# Altium schematic sheet [03] - ROGO MAIN.SchDoc
size A3; NameAuthor: Angle Vu
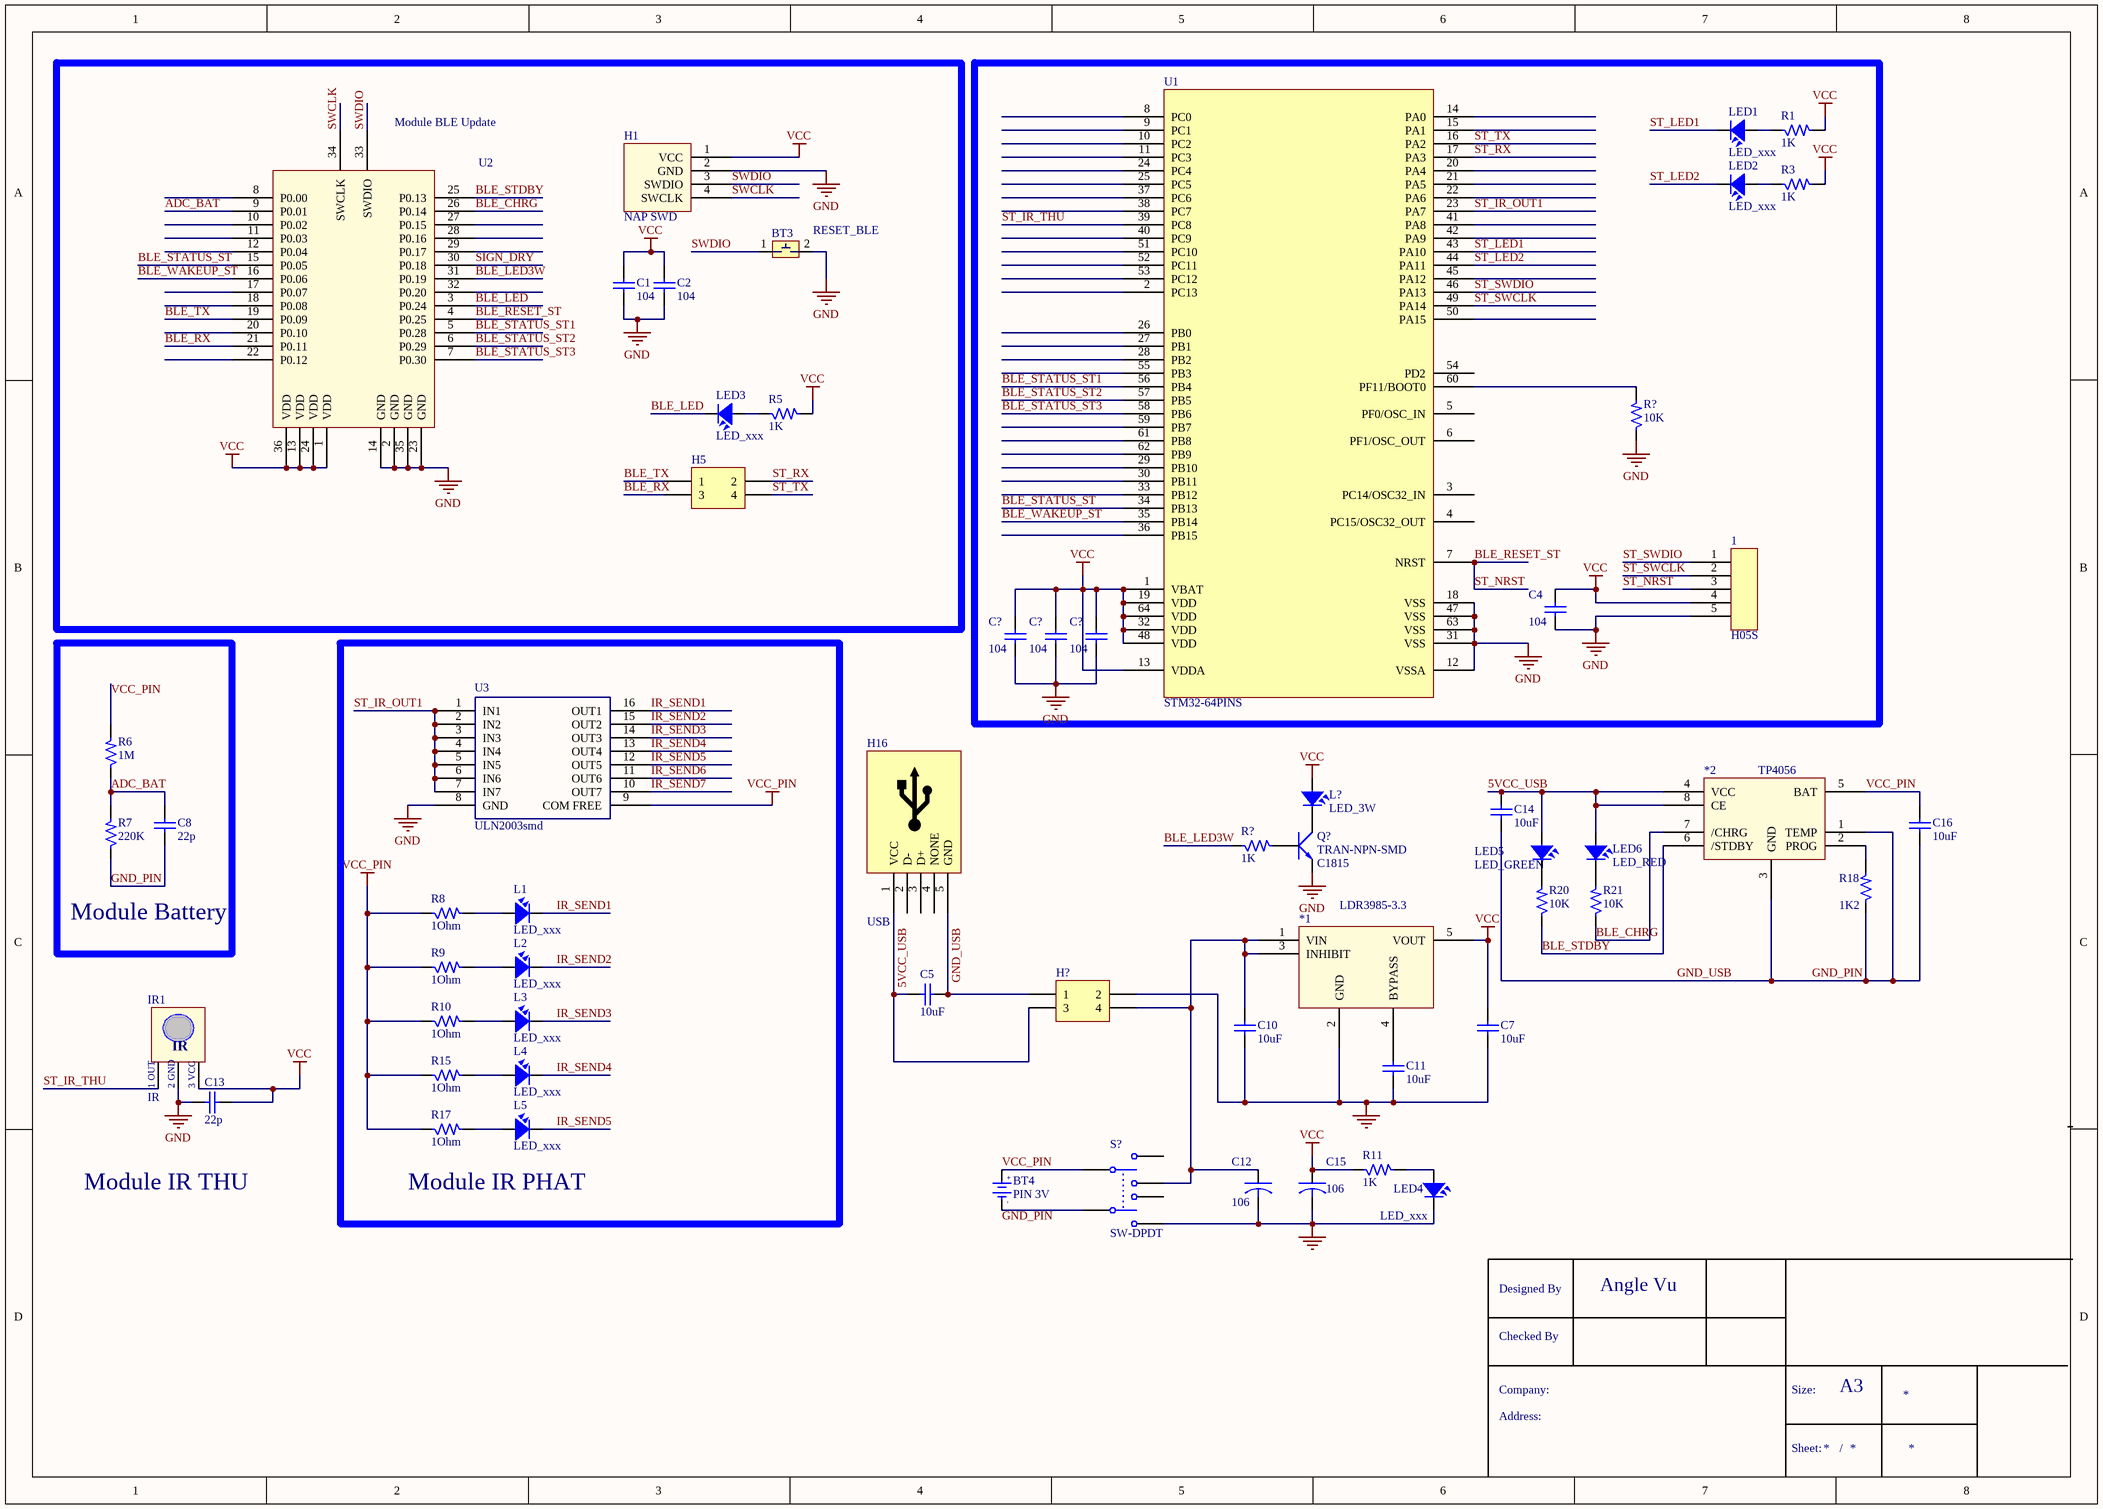
[diagram p0: [03] - ROGO MAIN.SchDoc]

## Parts
(Parts that share a designator on the sheet are numbered #1, #2 ... from top to bottom, then left to right.)
1  H05S  [H05SA]
*1  LDR3985-3.3  [LDR3985-3.3]
*2  TP4056  [TP4056]
BT3  RESET_BLE  [SW2-SMD]
BT4  PIN 3V  [H02MA]
C1  104  [0805]
C2  104  [0805]
C4  104  [0805]
C5  10uF  [0805]
C7  10uF  [0805]
C8  22p  [0805]
C10  10uF  [0805]
C11  10uF  [0805]
C12  106  [1206]
C13  22p  [0805]
C14  10uF  [0805]
C15  106  [1206]
C16  10uF  [0805]
C?#1  104  [0805]
C?#2  104  [0805]
C?#3  104  [0805]
H1  NAP SWD  [H04SA]
H5  H04M  [HDR2X2]  (value not drawn)
H16  USB  [Micro_USB]
H?  H04M  [HDR2X2]  (value not drawn)
IR1  IR  [H03SA]
L1  value LED_xxx  [LED_Z5]  (hidden comment: LED_Z5)
L2  value LED_xxx  [LED_Z5]  (hidden comment: LED_Z5)
L3  value LED_xxx  [LED_Z5]  (hidden comment: LED_Z5)
L4  value LED_xxx  [LED_Z5]  (hidden comment: LED_Z5)
L5  value LED_xxx  [LED_Z5]  (hidden comment: LED_Z5)
L?  value LED_3W  [LED_Z5]  (hidden comment: LED_Z5)
LED1  value LED_xxx  [0805]  (hidden comment: LED)
LED2  value LED_xxx  [0805]  (hidden comment: LED)
LED3  value LED_xxx  [0805]  (hidden comment: LED)
LED4  value LED_xxx  [0805]  (hidden comment: LED)
LED5  value LED_GREEN  [0805]  (hidden comment: LED)
LED6  value LED_RED  [0805]  (hidden comment: LED)
Q?  TRAN-NPN-SMD  value C1815  [TRAN-NPN-SMD]
R1  1K  [0805]
R3  1K  [0805]
R5  1K  [0805]
R6  1M  [0805]
R7  220K  [0805]
R8  1Ohm  [0805]
R9  1Ohm  [0805]
R10  1Ohm  [0805]
R11  1K  [0805]
R15  1Ohm  [0805]
R17  1Ohm  [0805]
R18  value 1K2  [0805]  (hidden comment: RESISTOR)
R20  value 10K  [0805]  (hidden comment: RESISTOR)
R21  value 10K  [0805]  (hidden comment: RESISTOR)
R?#1  value 10K  [0805]  (hidden comment: RESISTOR)
R?#2  value 1K  [0805]  (hidden comment: RESISTOR)
S?  SW-DPDT  [DPDT-6]
U1  STM32-64PINS  [LQFP64Pins]
U2  Module BLE Update  [Module Ble]
U3  ULN2003smd  [ULN2003-smd16P]

## Blocks framed on the sheet
Module Battery: C8 R6 R7
Module IR PHAT: L1-L5 R8-R10 R15 R17 U3

## Nets
GND: 1.5 *1.2(GND) BT3.2 C1.2 C2.2 C4.2 C7.2 C10.2 C11.2 C12.2 C13.2 C15.2 C?#1.2 C?#2.2 C?#3.2 H1.2(GND) H?.2 IR1.2(GND) LED4.2 Q?.2(E) R?#1.1 S?.6 U1.12(VSSA) U1.18(VSS) U1.31(VSS) U1.47(VSS) U1.63(VSS) U2.2(GND) U2.14(GND) U2.23(GND) U2.35(GND) U3.8(GND)
VCC: 1.4 *1.5(VOUT) C1.1 C2.1 C4.1 C7.1 C13.1 C15.1 C?#1.1 C?#2.1 C?#3.1 H1.1(VCC) IR1.3(VCC) L?.1 R1.2 R3.2 R5.2 R11.1 U1.1(VBAT) U1.13(VDDA) U1.19(VDD) U1.32(VDD) U1.48(VDD) U1.64(VDD) U2.1(VDD) U2.13(VDD) U2.24(VDD) U2.36(VDD)
VCC_PIN: *2.5(BAT) BT4.1(+3V) C16.1 R6.2 R8.1 R9.1 R10.1 R15.1 R17.1 S?.1 U3.9(COM_FREE)
5VCC_USB: *2.4(VCC) *2.8(CE) C5.2 C14.1 H16.1(VCC) H?.3 LED5.1 LED6.1
ADC_BAT: C8.2 R6.1 R7.2 U2.9(P0.01)
BLE_CHRG: *2.7(/CHRG) R21.1 U2.26(P0.14)
BLE_LED: LED3.2 U2.3(P0.24)
BLE_LED3W: R?#2.1 U2.31(P0.19)
BLE_RESET_ST: 1.3 U1.7(NRST) U2.4(P0.25)  [also labelled ST_NRST]
BLE_RX: H5.3 U2.21(P0.11)
BLE_STATUS_ST: U1.34(PB13) U2.15(P0.05)
BLE_STATUS_ST1: U1.56(PB4) U2.5(P0.28)
BLE_STATUS_ST2: U1.57(PB5) U2.6(P0.29)
BLE_STATUS_ST3: U1.58(PB6) U2.7(P0.30)
BLE_STDBY: *2.6(/STDBY) R20.1 U2.25(P0.13)
BLE_TX: H5.1 U2.19(P0.09)
BLE_WAKEUP_ST: U1.35(PB14) U2.16(P0.06)
GND_PIN: *2.1(TEMP) *2.3(GND) C5.1 C8.1 C14.2 C16.2 H16.5(GND) H?.1 R7.1 R18.1  [also labelled GND_USB]
IR_SEND1: L1.2 U3.16(OUT1)
IR_SEND2: L2.2 U3.15(OUT2)
IR_SEND3: L3.2 U3.14(OUT3)
IR_SEND4: L4.2 U3.13(OUT4)
IR_SEND5: L5.2 U3.12(OUT5)
IR_SEND6: U3.11(OUT6)
IR_SEND7: U3.10(OUT7)
SIGN_DRY: U2.30(P0.18)
ST_IR_OUT1: U1.23(PA7) U3.1(IN1) U3.2(IN2) U3.3(IN3) U3.4(IN4) U3.5(IN5) U3.6(IN6) U3.7(IN7)
ST_IR_THU: IR1.1(Out) U1.39(PC8)
ST_LED1: LED1.2 U1.43(PA10)
ST_LED2: LED2.2 U1.44(PA11)
ST_RX: H5.2 U1.17(PA3)
ST_SWCLK: 1.2 U1.49(PA14)
ST_SWDIO: 1.1 U1.46(PA13)
ST_TX: H5.4 U1.16(PA2)
SWCLK: H1.4(SWCLK) U2.34(SWCLK)
SWDIO: BT3.1 H1.3(SWDIO) U2.33(SWDIO)
Net*1_1: *1.1(VIN) *1.3(INHIBIT) C10.1 C12.1 H?.4 S?.3
Net*1_4: *1.4(BYPASS) C11.1
Net*2_2: *2.2(PROG) R18.2
NetBT4_2: BT4.2(GND) S?.4
NetL1_1: L1.1 R8.2
NetL2_1: L2.1 R9.2
NetL3_1: L3.1 R10.2
NetL4_1: L4.1 R15.2
NetL5_1: L5.1 R17.2
NetL?_2: L?.2 Q?.3(C)
NetLED1_1: LED1.1 R1.1
NetLED2_1: LED2.1 R3.1
NetLED3_1: LED3.1 R5.1
NetLED4_1: LED4.1 R11.2
NetLED5_2: LED5.2 R20.2
NetLED6_2: LED6.2 R21.2
NetQ?_1: Q?.1(B) R?#2.2
NetR?#1_2: R?#1.2 U1.60(PF11/BOOT0)

Not connected (* = marked no-connect by the designer): H16 0(6) 2(D-) 3(D+) 4(NONE); S? 2 5; U1 2(PC13) 3(PC14/OSC32_IN) 4(PC15/OSC32_OUT) 5(PF0/OSC_IN) 6(PF1/OSC_OUT) 8(PC0) 9(PC1) 10(PC2) 11(PC3) 14(PA0) 15(PA1) 20(PA4) 21(PA5) 22(PA6) 24(PC4) 25(PC5) 26(PB0) 27(PB1) 28(PB2) 29(PB10) 30(PB11) 33(PB12) 36(PB15) 37(PC6) 38(PC7) 40(PC9) 41(PA8) 42(PA9) 45(PA12) 50(PA15) 51(PC10) 52(PC11) 53(PC12) 54(PD2) 55(PB3) 59(PB7) 61(PB8) 62(PB9); U2 8(P0.00) 10(P0.02) 11(P0.03) 12(P0.04) 17(P0.07) 18(P0.08) 20(P0.10) 22(P0.12) 27(P0.15) 28(P0.16) 29(P0.17) 32(P0.20)

## Notes on the sheet
- Module IR THU
- Labels drawn without touching a wire or pin: GND_PIN
- Designed By
- Checked By
- Company:
- Size:
- A3
- Address:
- Sheet:
- /
- (in symbol IR) 1 OUT; 2 GND; 3 VCC
- (in symbol PIN 3V) +; -

## Library data of the parts
1 = H05S: HEADER, SINGLE
BT3 = BUTTON 2 PIN
BT4 = PIN 3V: Battery 3VDC; Value: PIN 3V
C1 C2 C4 C5 C7 C8 C10 C11 C13 C14 C16 C?#1-C?#3 = Cap
C12 C15 = CAPACITOR
H5 H? = H04M: HEADER, DOUBLE; LatestRevisionDate: 17-Jul-2002; LatestRevisionNote: Re-released for DXP Platform.; Publisher: Altium Limited
H16 = USB: USB conector
IR1 = IR: Receiver Infraed IC
L1-L5 L? = LED_Z5: LED Single colour Green and Red
LED1-LED6 = LED: LED Single colour Green and Red
Q? = TRAN-NPN-SMD: NPN 600mW, ECB
R1 R3 R5-R11 R15 R17 = Res: Resistor 1/4W; Value: R1/4W - 1K
R18 R20 R21 R?#1 R?#2 = RESISTOR: Resistor 1/4W
S? = SW-DPDT: Double-Pole, Double-Throw Switch; Published: 24-Mar-1999; LatestRevisionDate: 17-Jul-2002; LatestRevisionNote: Re-released for DXP Platform.; PackageReference: DPDT-6; Publisher: Altium Limited; PackageDescription: Switch; 6 Leads